# Altium schematic sheet IO.SchDoc
size A3; SheetNumber: 2; SheetTotal: 3
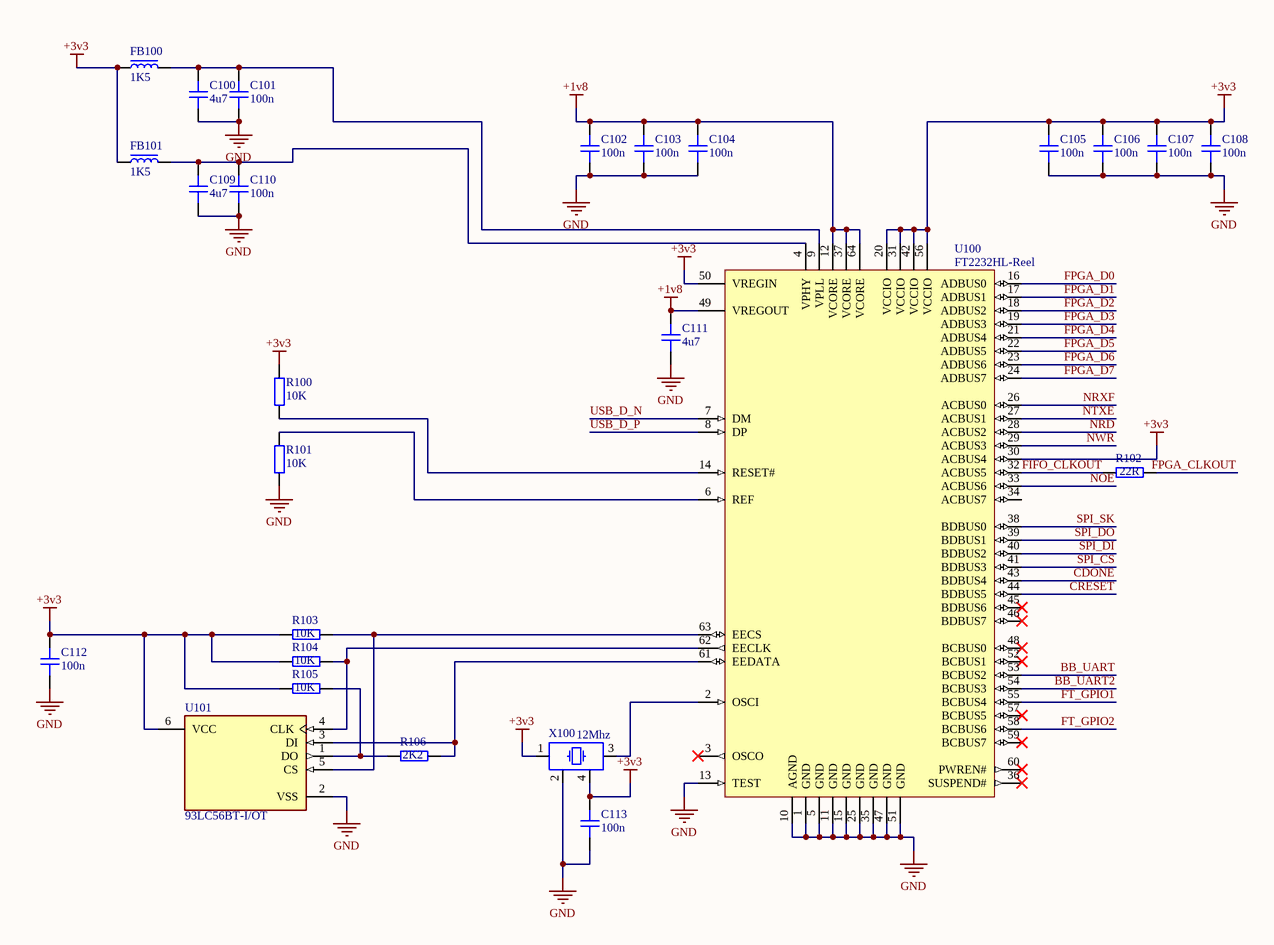
[diagram p0: IO.SchDoc]

## Parts
C100  4u7  [CAP_0402]
C101  100n  [CAP_0402]
C102  100n  [CAP_0402]
C103  100n  [CAP_0402]
C104  100n  [CAP_0402]
C105  100n  [CAP_0402]
C106  100n  [CAP_0402]
C107  100n  [CAP_0402]
C108  100n  [CAP_0402]
C109  4u7  [CAP_0402]
C110  100n  [CAP_0402]
C111  4u7  [CAP_0402]
C112  100n  [CAP_0402]
C113  100n  [CAP_0402]
FB100  1K5  [FB_0603]
FB101  1K5  [FB_0603]
R100  10K  [RES_0402]
R101  10K  [RES_0402]
R102  22R  [RES_0402]
R103  10K  [RES_0402]
R104  10K  [RES_0402]
R105  10K  [RES_0402]
R106  2K2  [RES_0402]
U100  FT2232HL-Reel  [LQFP-64_M]
U101  93LC56BT-I/OT  [FP-C04-028-MFG]
X100  12Mhz  [XTAL_2520]

## Nets
+1v8: C102.2 C103.2 C104.2 C111.2 U100.12(VCORE) U100.37(VCORE) U100.49(VREGOUT) U100.64(VCORE)
+3v3: C105.2 C106.2 C107.2 C108.2 C112.2 C113.2 FB100.1 FB101.1 R100.2 R103.1 R104.1 R105.1 U100.20(VCCIO) U100.30(ACBUS4) U100.31(VCCIO) U100.42(VCCIO) U100.50(VREGIN) U100.56(VCCIO) U101.6(VCC) X100.1 X100.4
GND: C100.1 C101.1 C102.1 C103.1 C104.1 C105.1 C106.1 C107.1 C108.1 C109.1 C110.1 C111.1 C112.1 C113.1 R101.2 U100.1(GND) U100.5(GND) U100.10(AGND) U100.11(GND) U100.13(TEST) U100.15(GND) U100.25(GND) U100.35(GND) U100.47(GND) U100.51(GND) U101.2(VSS) X100.2
BB_UART: U100.53(BCBUS2)
BB_UART2: U100.54(BCBUS3)
CDONE: U100.43(BDBUS4)
CRESET: U100.44(BDBUS5)
FIFO_CLKOUT: R102.1 U100.32(ACBUS5)
FPGA_CLKOUT: R102.2
FPGA_D0: U100.16(ADBUS0)
FPGA_D1: U100.17(ADBUS1)
FPGA_D2: U100.18(ADBUS2)
FPGA_D3: U100.19(ADBUS3)
FPGA_D4: U100.21(ADBUS4)
FPGA_D5: U100.22(ADBUS5)
FPGA_D6: U100.23(ADBUS6)
FPGA_D7: U100.24(ADBUS7)
FT_GPIO1: U100.55(BCBUS4)
FT_GPIO2: U100.58(BCBUS6)
NOE: U100.33(ACBUS6)
NRD: U100.28(ACBUS2)
NRXF: U100.26(ACBUS0)
NTXE: U100.27(ACBUS1)
NWR: U100.29(ACBUS3)
SPI_CS: U100.41(BDBUS3)
SPI_DI: U100.40(BDBUS2)
SPI_DO: U100.39(BDBUS1)
SPI_SK: U100.38(BDBUS0)
USB_D_N: U100.7(DM)
USB_D_P: U100.8(DP)
NetC100_2: C100.2 C101.2 FB100.2 U100.9(VPLL)
NetC109_2: C109.2 C110.2 FB101.2 U100.4(VPHY)
NetR100_1: R100.1 U100.14(RESET#)
NetR101_1: R101.1 U100.6(REF)
NetR103_2: R103.2 U100.63(EECS) U101.5(CS)
NetR104_2: R104.2 U100.62(EECLK) U101.4(CLK)
NetR105_2: R105.2 R106.1 U101.1(DO)
NetR106_2: R106.2 U100.61(EEDATA) U101.3(DI)
NetU100_2: U100.2(OSCI) X100.3

Not connected (* = marked no-connect by the designer): U100 3(OSCO)* 34(ACBUS7) 36(SUSPEND#)* 45(BDBUS6)* 46(BDBUS7)* 48(BCBUS0)* 52(BCBUS1)* 57(BCBUS5)* 59(BCBUS7)* 60(PWREN#)*

## Library data of the parts
C100 C109 C111 = CAP_0402: Capacitor SMD 0402; Manufacturer Part Number: GRM155R61E475ME15D; Manufacturer: *; Distributor Link: *; LCSC: C2858031; Rating: *; Dielectric: *
C101-C108 C110 C112 C113 = CAP_0402: Capacitor SMD 0402; Manufacturer Part Number: CL05B104KO5NNNC; Manufacturer: *; Distributor Link: *; LCSC: C1525; Rating: *; Dielectric: *
FB100 FB101 = FB_0603: Ferrite Bead SMD 0603; Manufacturer Part Number: BLM18HE152SN1D; Manufacturer: *; Distributor Link: *; LCSC: C82155
R100 R101 R103-R105 = RES_0402: Resistor SMD 0402; Manufacturer Part Number: 0402WGF1002TCE; Manufacturer: *; Distributor Link: *; LCSC: C25744
R102 = RES_0402: Resistor SMD 0402; Manufacturer Part Number: 0402WGF220JTCE; Manufacturer: *; Distributor Link: *; LCSC: C25092
R106 = RES_0402: Resistor SMD 0402; Manufacturer Part Number: 0402WGF2201TCE; Manufacturer: *; Distributor Link: *; LCSC: C25879
U100 = CMP-0078-00023-3: Dual High Speed USB To Multipurpose UART/FIFO IC, 64-pin LQFP, Tape and Reel; Manufacturer: FTDI; DatasheetVersion: ver 2.21, Jun-2012; ComponentLink1URL: http://www.ftdichip.com/; Manufacturer Part Number: FT2232HL-Reel; ComponentLink2Description: Datasheet; RevisionNote: DatasheetVersion updated to 2.21 Jun-2012; PackageVersion: Jun-12; ComponentLink1Description: Manufacturer URL; ComponentLink2URL: http://www.ftdichip.com/Support/Documents/DataSheets/ICs/DS_FT2232H.pdf; PackageReference: LQFP-64; PackageDescription: 64-Pin Thin Quad Flat Pack, 10 x 10 x 1.4 mm Body, 0.5 mm Pitch; LCSC: C27882
U101 = CMP-0162-00356-2: IC EEPROM 2K SPI 2MHZ SOT23-6; Access Time: 250ns; Density: 2Kb; Max Supply Voltage: 5.5V; Interface: Serial; Min Supply Voltage: 2.5V; Nominal Supply Current: 2mA; Number of Pins: 6; Radiation Hardening: No; Length: 3.1mm; Height: 1.3mm; Min Operating Temperature: -40°C; Max Operating Temperature: 85°C; Lead Free: Lead Free; Memory Type: EEPROM; Contact Plating: Tin; REACH SVHC: No SVHC; Package Quantity: 3000; Frequency: 2MHz; Width: 1.8mm; Max Frequency: 2MHz; Case/Package: SOT-23; Mount: Surface Mount; Packaging: Tape and Reel; Memory Size: 2Kb; LCSC: C190271; Manufacturer Part Number: 93LC56BT-I/OT
X100 = XTAL_2520: Crystal SMD 2520; Manufacturer Part Number: SX2M12.000B10F20TNN; Manufacturer: *; Distributor Link: *; LCSC: C7431262